# Altium schematic sheet pca10040_sheet3_buttons_and_leds.SchDoc: PCA10040 - Buttons and LEDs
size A4; Revision: 1.1.1; SheetNumber: 3; SheetTotal: 5; DrawnBy: KJP; ProjectNumber: 4397; PCBRevision: 0071KJP; DocumentSize: A4; PCAName: PCA10040; PCBNumber: 400150; ProjectName: Quark
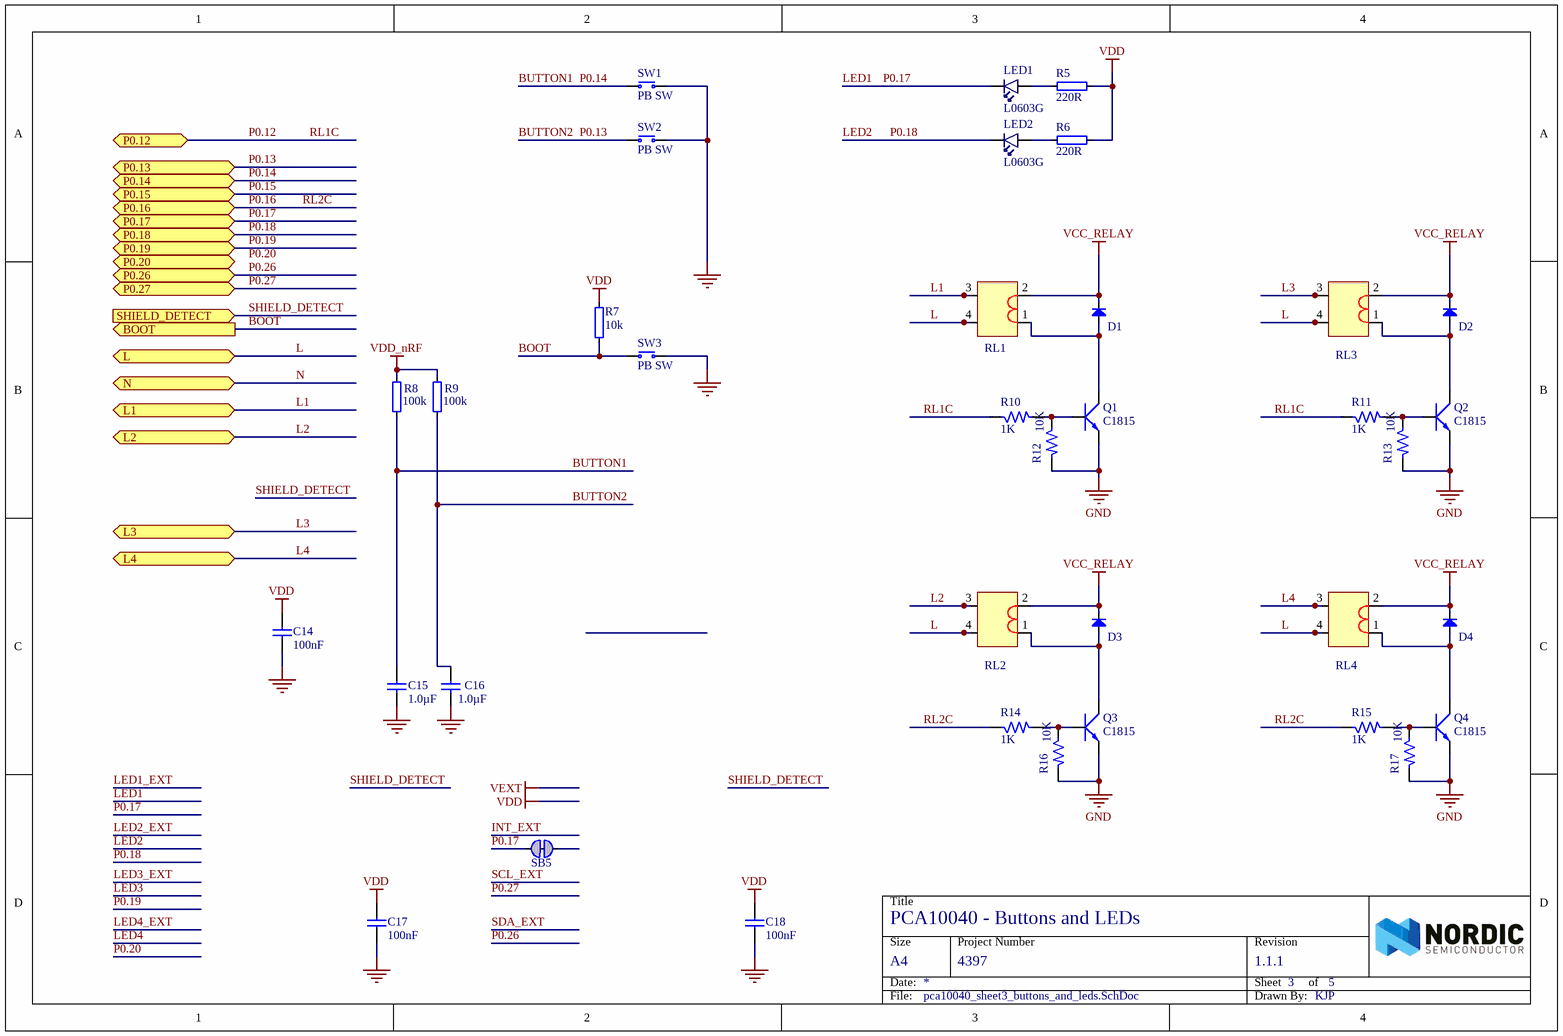
[diagram p0: pca10040_sheet3_buttons_and_leds.SchDoc]

## Parts
C14  100nF  [CAPC1005X04L]
C15  1.0µF  [CAPC1608X06L]
C16  1.0µF  [CAPC1608X06L]
C17  100nF  [CAPC1005X04L]
C18  100nF  [CAPC1005X04L]
D1  Diode SMD  [DIO-SMD-123]  (value not drawn)
D2  Diode SMD  [DIO-SMD-123]  (value not drawn)
D3  Diode SMD  [DIO-SMD-123]  (value not drawn)
D4  Diode SMD  [DIO-SMD-123]  (value not drawn)
LED1  L0603G  [LED_0603_G]
LED2  L0603G  [LED_0603_G]
Q1  C1815  [SOT23B]
Q2  C1815  [SOT23B]
Q3  C1815  [SOT23B]
Q4  C1815  [SOT23B]
R5  220R  [0603]
R6  220R  [0603]
R7  10k  [RESC1005X04L]
R8  100k  [0603]
R9  100k  [0603]
R10  1K  [0603]
R11  1K  [0603]
R12  10K  [0603]
R13  10K  [0603]
R14  1K  [0603]
R15  1K  [0603]
R16  10K  [0603]
R17  10K  [0603]
RL1  Component_1  [AZ7705]  (value not drawn)
RL2  Component_1  [AZ7705]  (value not drawn)
RL3  Component_1  [AZ7705]  (value not drawn)
RL4  Component_1  [AZ7705]  (value not drawn)
SB5  Solderbridge  [Solderbridge_Shorted]  (value not drawn)  (net tie, no BOM)
SW1  PB SW  [D2FC-F-7N]
SW2  PB SW  [D2FC-F-7N]
SW3  PB SW  [Switch-PB-6.2x6.3mm-SMD]

## Ports
BOOT (out), L1 (bidir), L2 (bidir), L3 (bidir), L4 (bidir), L (bidir), N (bidir), P0.12 (bidir), P0.13 (bidir), P0.14 (bidir), P0.15 (bidir), P0.16 (bidir), P0.17 (bidir), P0.18 (bidir), P0.19 (bidir), P0.20 (bidir), P0.26 (bidir), P0.27 (bidir), SHIELD_DETECT (in)

## Nets
GND: C14.1 C15.2 C16.1 C17.1 C18.1 Q1.3(E) Q2.3(E) Q3.3(E) Q4.3(E) R12.2 R13.2 R16.2 R17.2 SW1.1(N.O) SW2.1(N.O) SW3.1(N.O)
VCC_RELAY: D1.2(K) D2.2(K) D3.2(K) D4.2(K) RL1.2 RL2.2 RL3.2 RL4.2
VDD: C14.2 C17.2 C18.2 R5.2 R6.2 R7.2
VDD_nRF: R8.2 R9.2
BOOT: R7.1 SW3.2(COM) ; port BOOT
BUTTON1: C15.1 R8.1 SW1.2(COM) ; port P0.14  [also labelled P0.14]
BUTTON2: C16.2 R9.1 SW2.2(COM) ; port P0.13  [also labelled P0.13]
L: RL1.4 RL2.4 RL3.4 RL4.4 ; port L
L1: RL1.3 ; port L1
L2: RL2.3 ; port L2
L3: RL3.3 ; port L3
L4: RL4.3 ; port L4
LED1: LED1.1(C) SB5.1 ; port P0.17  [also labelled P0.17]
LED2: LED2.1(C) ; port P0.18  [also labelled P0.18]
N: port N
P0.12: R10.1 R11.1 ; port P0.12  [also labelled RL1C]
P0.15: port P0.15
P0.16: R14.1 R15.1 ; port P0.16  [also labelled RL2C]
P0.19: port P0.19
P0.26: port P0.26
P0.27: port P0.27
SHIELD_DETECT: port SHIELD_DETECT
NetD1_1: D1.1(A) Q1.2(C) RL1.1
NetD2_1: D2.1(A) Q2.2(C) RL3.1
NetD3_1: D3.1(A) Q3.2(C) RL2.1
NetD4_1: D4.1(A) Q4.2(C) RL4.1
NetLED1_2: LED1.2(A) R5.1
NetLED2_2: LED2.2(A) R6.1
NetQ1_1: Q1.1(B) R10.2 R12.1
NetQ2_1: Q2.1(B) R11.2 R13.1
NetQ3_1: Q3.1(B) R14.2 R16.1
NetQ4_1: Q4.1(B) R15.2 R17.1

Not connected (* = marked no-connect by the designer): SB5 2(1)

## Notes on the sheet
- Labels drawn without touching a wire or pin: P0.20
- Title
- Size
- Date:
- Project Number
- Sheet         of
- Revision
- File:
- Drawn By:

## Library data of the parts
C14 C17 C18 = C0402-100n: Capacitor, X7R, ±10%; Note: 16V; Artikkelnr Noca: 20039200; Artikkelnr Simpro: N.A.; Part Number: C0402-100n; Manufacturer: *; Manufacturer Part Number: *; Datasheet: *; Footprint Doc: 0402; LatestRevisionDate: 2009-11-23; Pin Count: 2; Publisher: Nordic Semiconductor; Published: 2009-05-08; Value: 100nF; Supplier: *; Supplier part number: *; 2nd source Supplier: *; 2nd source part number: *
C15 C16 = C0402-1µ0: Capacitor, X5R, ±5%; Note: 6.3V; Artikkelnr Noca: 20039235; Artikkelnr Simpro: N.A.; Part Number: C0402-1µ0; Manufacturer: *; Manufacturer Part Number: *; Datasheet: *; Footprint Doc: 0402; LatestRevisionDate: 2009-11-23; Pin Count: 2; Publisher: Nordic Semiconductor; Published: 2009-05-08; Value: 1.0µF; Supplier: *; Supplier part number: *; 2nd source Supplier: *; 2nd source part number: *
D1-D4 = Diode SMD: Default Diode; Code - JEDEC: DO-214-AB; Value: 1N5007; Published: 8-Jun-2000; Revision: July-2002: Re-released for DXP Platform.; Publisher: Altium Limited
LED1 LED2 = LG L29K Smartled Green: LED SMARTLED GREEN 570NM 0603; Manufacturer: Multicomp; Manufacturer Part Number: LG L29K-G2J1-24-Z; Note: 2,24..5.6 mcd, Vfmin=1.7V; Artikkelnr Noca: N.A.; Part Number: LG L29K Smartled Green; Datasheet: http://www.osram-os.com/Graphics/XPic2/00077107_0.pdf; Footprint Doc: 0603; LatestRevisionDate: 2014-10-28; Pin Count: 2; Publisher: Nordic Semiconductor; Published: 2014-10-28; Value: L0603G; Supplier: Digi-Key; Supplier part number: 475-2709-1-ND; 2nd source Supplier: *; 2nd source part number: *; Artikkelnr Simpro: N.A.
Q1-Q4 = C1815: NPN 600mW, ECB; Value: C1815
R5 R6 = R0402-220: Resistor, ±1%, 0.063W; Note: Chip Res 1%; Artikkelnr Noca: 27049057; Artikkelnr Simpro: N.A.; Part Number: R0402-220; Manufacturer: *; Manufacturer Part Number: *; Datasheet: *; LatestRevisionDate: 2009-11-23; Pin Count: 2; Publisher: Nordic Semiconductor; Published: 2009-05-08; Value: 220R; Supplier: Farnell; Supplier part number: 173-8841; 2nd source Supplier: *; 2nd source part number: *; Footprint Doc: 0402
R7 = R0402-10k: Resistor, ±1%, 0.063W; Note: Chip Res 1%; Artikkelnr Noca: 27049097; Artikkelnr Simpro: N.A.; Part Number: R0402-10k; Manufacturer: *; Manufacturer Part Number: *; Datasheet: *; Footprint Doc: 0402; LatestRevisionDate: 2009-11-23; Pin Count: 2; Publisher: Nordic Semiconductor; Published: 2009-05-08; Value: 10k; Supplier: Farnell; Supplier part number: 173-8864; 2nd source Supplier: *; 2nd source part number: *
R8 R9 = R0402-100k: Resistor, ±1%, 0.063W; Note: Chip Res 1%; Artikkelnr Noca: 27049121; Artikkelnr Simpro: N.A.; Part Number: R0402-100k; Manufacturer: *; Manufacturer Part Number: *; Datasheet: *; Footprint Doc: 0402; LatestRevisionDate: 2009-11-23; Pin Count: 2; Publisher: Nordic Semiconductor; Published: 2009-05-08; Value: 100k; Supplier: Farnell; Supplier part number: 173-8877; 2nd source Supplier: *; 2nd source part number: *
R10-R17 = R: Resistor 1/4W; Value: R1/4W - 1K
SB5 = Solderbridge Shorted: Shorted Solderbridge; Artikkelnr Noca: N.A.; Part Number: Solderbridge Shorted; Manufacturer: *; Manufacturer Part Number: *; Datasheet: *; LatestRevisionDate: 2012-08-07; Pin Count: 2; Publisher: Nordic Semiconductor; Published: 2012-08-07; Value: Solderbridge; Note: *; Supplier: *; Supplier part number: *; 2nd source Supplier: *; 2nd source part number: *; Footprint Doc: Solderbridge_Shorted; Artikkelnr Simpro: N.A.
SW1-SW3 = Switch-PB-6.2x6.3mm-SMD: Tactile Switch, SPNO, SMD, 160gf, 6.2x6.3x2.5mm; Manufacturer: Dailywell; Manufacturer Part Number: TS604VM1-025BR-R; 2nd source part number: 688-SKHUALE010; Artikkelnr Noca: 50019106; Artikkelnr Simpro: N.A.; Part Number: Switch-PB-6.2x6.3mm-SMD; Datasheet: \\hizz\pro\app9717\Datasheet\switches\Daliywell\TS604VM1-025BR-R.pdf; Footprint Doc: Switch-PB-6.2x6.3mm-SMD; LatestRevisionDate: 2016-04-21; Pin Count: 4; Publisher: Nordic Semiconductor; Published: 2010-02-01; Value: PB SW; Note: *; Supplier: Cabcon; Supplier part number: TS604VM1-025BR-R; 2nd source Supplier: Mouser